# Altium project PCB_Project1.PrjPCB
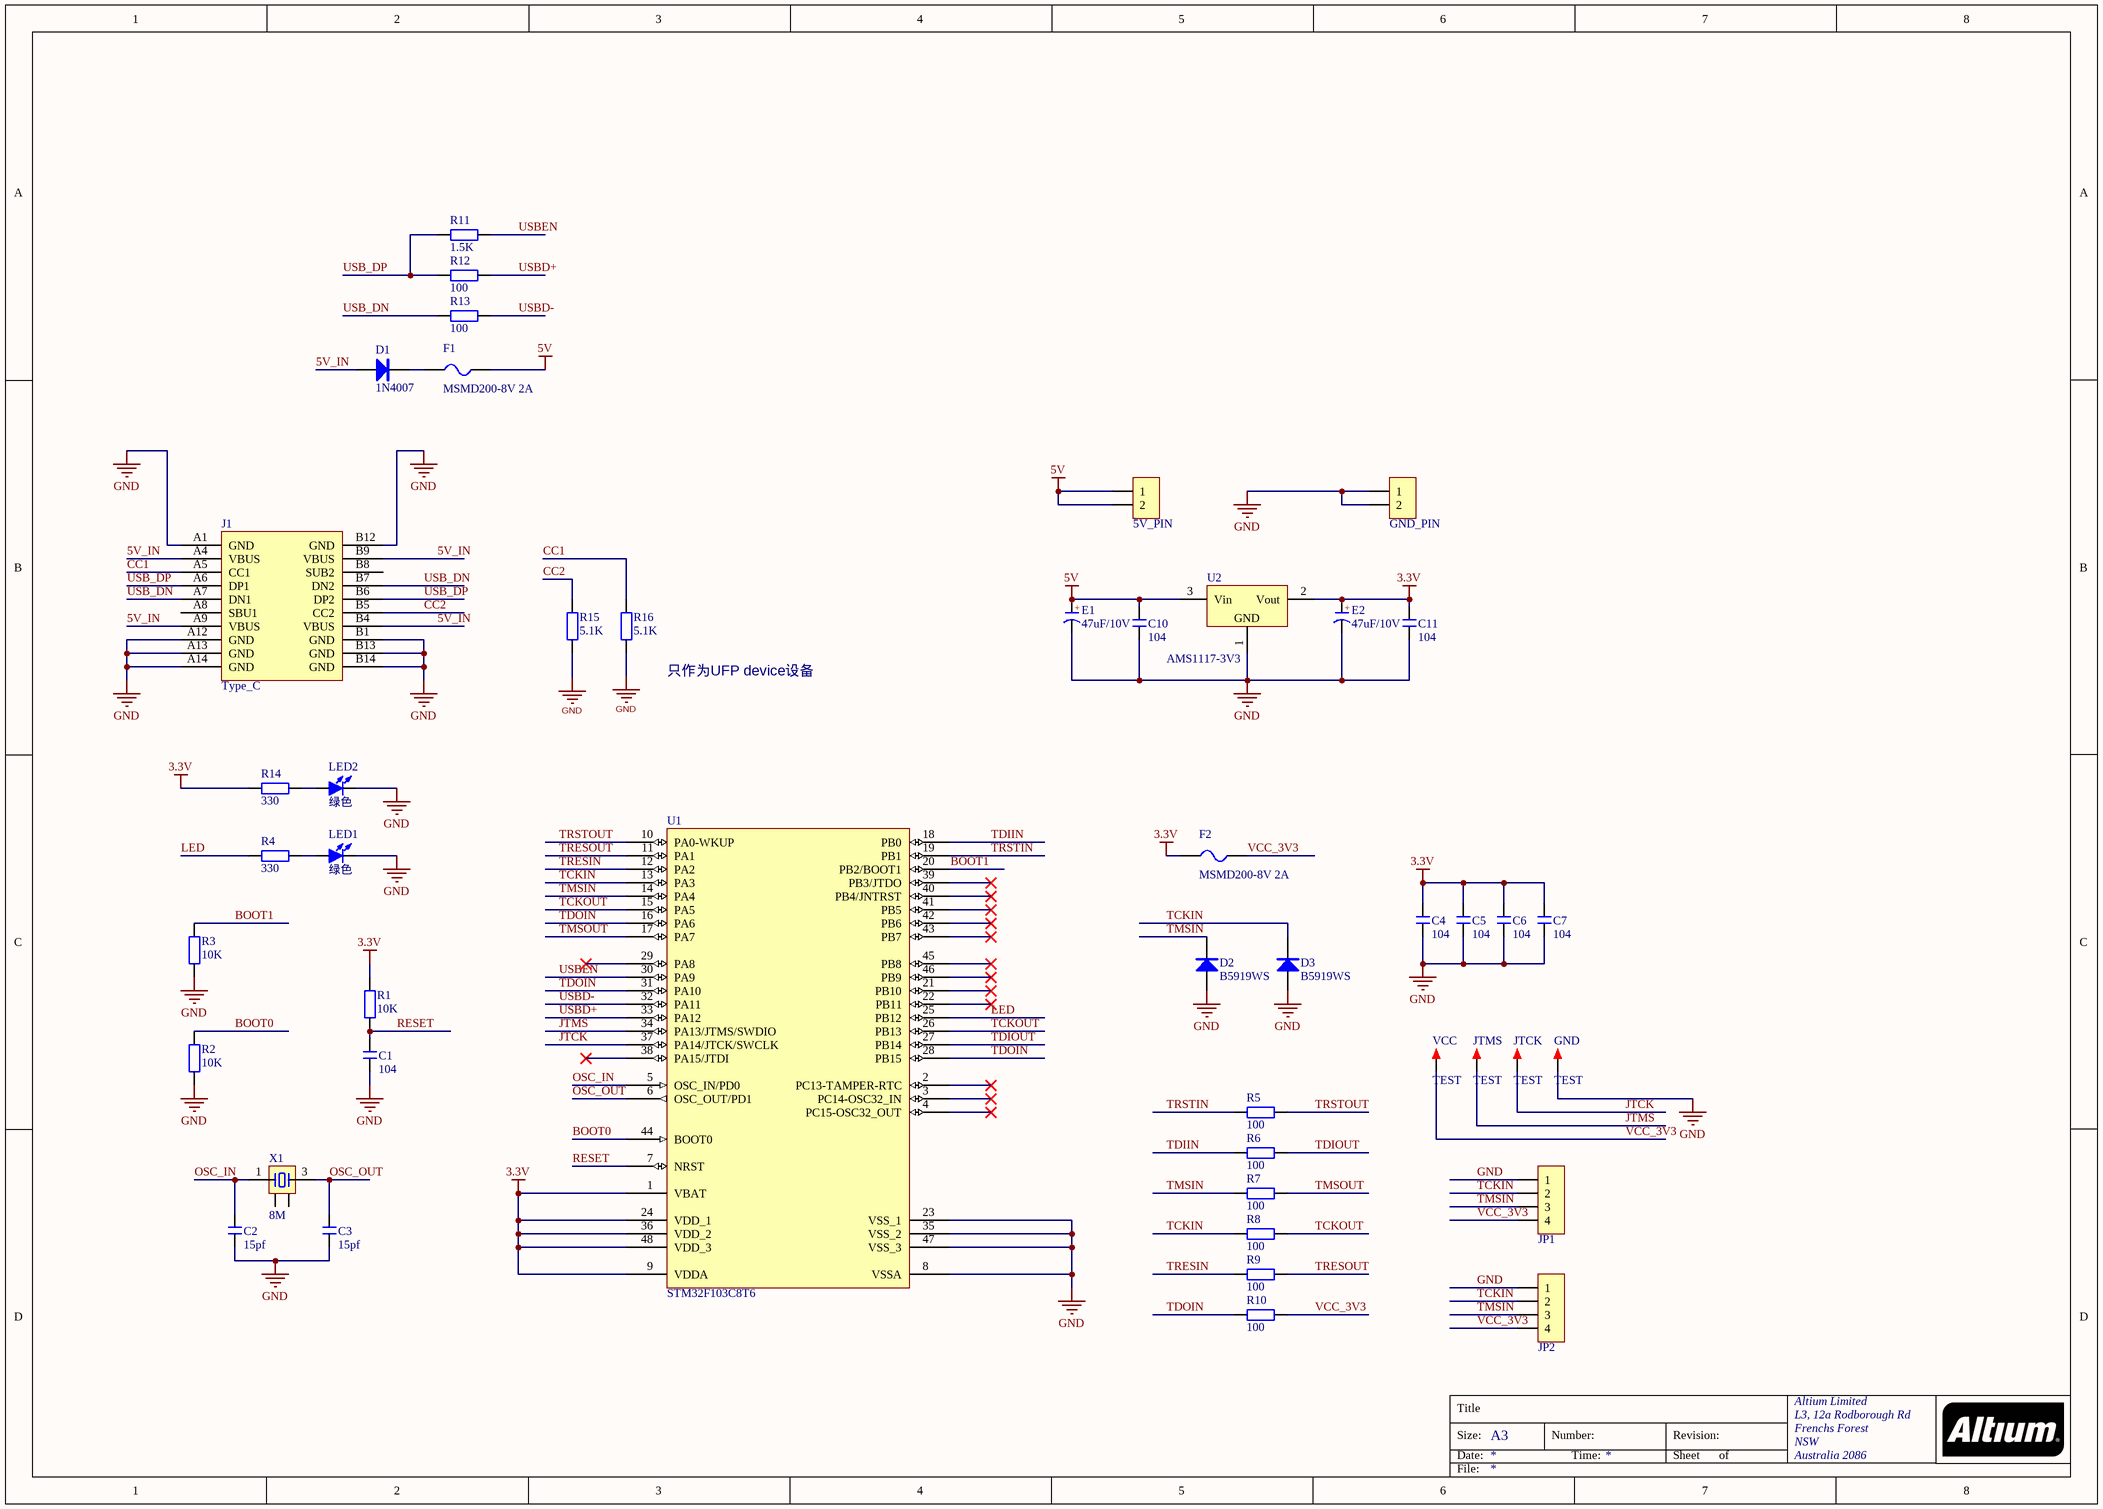
[diagram p0: Sheet1.SchDoc]
1 sheet, 46 parts. Net scope: global (net labels, ports and power ports of the same name join across sheets).
Board file: PCB1.PcbDoc

## Sheet Sheet1.SchDoc
size A3; Organization: Altium Limited; Address1: L3, 12a Rodborough Rd; Address2: Frenchs Forest; Address3: NSW; Address4: Australia 2086

### Parts
5V_PIN  HDR-1X2  [HDR2.54-LI-2P]  (value not drawn)
C1  104  [C 0603_L]
C2  15pf  [C 0603_L]
C3  15pf  [C 0603_L]
C4  104  [C 0603_L]
C5  104  [C 0603_L]
C6  104  [C 0603_L]
C7  104  [C 0603_L]
C10  104  [C 0603_L]
C11  104  [C 0603_L]
D1  1N4007  [SOD-123]
D2  B5919WS  [SOD-323]
D3  B5919WS  [SOD-323]
E1  47uF/10V  [CD B(3528)]
E2  47uF/10V  [CD B(3528)]
F1  MSMD200-8V 2A  [FU 0805]
F2  MSMD200-8V 2A  [FU 0805]
GND  TEST  [TEST 1.4]
GND_PIN  HDR-1X2  [HDR2.54-LI-2P]  (value not drawn)
J1  Type_C  [TYPE-C-16P]
JP1  HDR-1X4  [MX 1.25-WI-4P]  (value not drawn)
JP2  HDR-1X4  [XH2.54-WI-4P]  (value not drawn)
JTCK  TEST  [TEST 1.4]
JTMS  TEST  [TEST 1.4]
LED1  绿色  [LED 0805G]
LED2  绿色  [LED 0805G]
R1  10K  [R 0603_L]
R2  10K  [R 0603_L]
R3  10K  [R 0603_L]
R4  330  [R 0603_L]
R5  100  [R 0603_L]
R6  100  [R 0603_L]
R7  100  [R 0603_L]
R8  100  [R 0603_L]
R9  100  [R 0603_L]
R10  100  [R 0603_L]
R11  1.5K  [R 0603_L]
R12  100  [R 0603_L]
R13  100  [R 0603_L]
R14  330  [R 0603_L]
R15  5.1K  [R 0603_L]
R16  5.1K  [R 0603_L]
U1  STM32F103C8T6  [LQFP48_N]
U2  AMS1117-3V3  [SOT223_L]
VCC  TEST  [TEST 1.4]
X1  8M  [OSC 5032-4P]

### Nets
3.3V: C4.2 C5.2 C6.2 C7.2 C11.2 E2.1(A) F2.1 R1.2 R14.2 U1.1(VBAT) U1.9(VDDA) U1.24(VDD_1) U1.36(VDD_2) U1.48(VDD_3) U2.2(Vout)
5V: 5V_PIN.1 5V_PIN.2 C10.2 E1.1(A) F1.2 U2.3(Vin)
GND: C1.1 C2.1 C3.1 C4.1 C5.1 C6.1 C7.1 C10.1 C11.1 D2.1(A) D3.1(A) E1.2(K) E2.2(K) GND.1 GND_PIN.1 GND_PIN.2 J1.A1(GND) J1.A12(GND) J1.A13(GND) J1.A14(GND) J1.B1(GND) J1.B12(GND) J1.B13(GND) J1.B14(GND) JP1.1 JP2.1 LED1.2(K) LED2.2(K) R2.2 R3.2 R15.2 R16.2 U1.8(VSSA) U1.23(VSS_1) U1.35(VSS_2) U1.47(VSS_3) U2.1(GND)
5V_IN: D1.1(A) J1.A4(VBUS) J1.A9(VBUS) J1.B4(VBUS) J1.B9(VBUS)
BOOT0: R2.1 U1.44(BOOT0)
BOOT1: R3.1 U1.20(PB2/BOOT1)
CC1: J1.A5(CC1) R16.1
CC2: J1.B5(CC2) R15.1
JTCK: JTCK.1 U1.37(PA14/JTCK/SWCLK)
JTMS: JTMS.1 U1.34(PA13/JTMS/SWDIO)
LED: R4.2 U1.25(PB12)
OSC_IN: C2.2 U1.5(OSC_IN/PD0) X1.1
OSC_OUT: C3.2 U1.6(OSC_OUT/PD1) X1.3
RESET: C1.2 R1.1 U1.7(NRST)
TCKIN: D3.2(K) JP1.2 JP2.2 R8.2 U1.13(PA3)
TCKOUT: R8.1 U1.15(PA5) U1.26(PB13)
TDIIN: R6.2 U1.18(PB0)
TDIOUT: R6.1 U1.27(PB14)
TDOIN: R10.2 U1.16(PA6) U1.28(PB15) U1.31(PA10)
TMSIN: D2.2(K) JP1.3 JP2.3 R7.2 U1.14(PA4)
TMSOUT: R7.1 U1.17(PA7)
TRESIN: R9.2 U1.12(PA2)
TRESOUT: R9.1 U1.11(PA1)
TRSTIN: R5.2 U1.19(PB1)
TRSTOUT: R5.1 U1.10(PA0-WKUP)
USB_DN: J1.A7(DN1) J1.B7(DN2) R13.2
USB_DP: J1.A6(DP1) J1.B6(DP2) R11.2 R12.2
USBD+: R12.1 U1.33(PA12)
USBD-: R13.1 U1.32(PA11)
USBEN: R11.1 U1.30(PA9)
VCC_3V3: F2.2 JP1.4 JP2.4 R10.1 VCC.1
NetD1_2: D1.2(K) F1.1
NetLED1_1: LED1.1(A) R4.1
NetLED2_1: LED2.1(A) R14.1

Not connected (* = marked no-connect by the designer): J1 A8(SBU1) B8(SUB2); U1 2(PC13-TAMPER-RTC)* 3(PC14-OSC32_IN)* 4(PC15-OSC32_OUT)* 21(PB10)* 22(PB11)* 29(PA8)* 38(PA15/JTDI)* 39(PB3/JTDO)* 40(PB4/JNTRST)* 41(PB5)* 42(PB6)* 43(PB7)* 45(PB8)* 46(PB9)*; X1 2 4

### Notes on the sheet
- (near R16) 只作为UFP device设备
- Title
- Size:
- Date:
- A3
- Number:
- Time:
- Revision:
- Sheet
- of
- File:
- (in symbol C-CD) +

### Library data of the parts
5V_PIN GND_PIN = Header 2: 2P接插件; 版权归属: 源创客; BOM名称: 2P接插件; 学习资源: www.ooocke.com
C1-C7 C10 C11 = C: 无极性贴片电容; 版权归属: 源创客; BOM名称: 无极性贴片电容; 学习资源: www.ooocke.com
D1 = 1N4007: 整流二极管; 版权归属: 源创客; BOM名称: 整流二极管; 学习资源: www.ooocke.com
D2 D3 = 1N5819: 肖特基二极管; 版权归属: 源创客; 属性: 40V/2A; BOM名称: 肖特基二极管; 学习资源: www.ooocke.com
E1 E2 = C-CD: 贴片钽电容; 版权归属: 源创客; BOM名称: 贴片钽电容; 学习资源: www.ooocke.com
F1 F2 = FU: 贴片保险丝; 版权归属: 源创客; BOM名称: 贴片保险丝; 学习资源: www.ooocke.com
GND JTCK JTMS VCC = TEST: 测试点; 版权归属: 源创客; BOM名称: 测试点; 学习资源: www.ooocke.com
J1 = Type_C: 厂家：乐沪，型号：USB TYPE C 16PF
JP1 JP2 = Header 4: 4P接插件; 版权归属: 源创客; BOM名称: 4P接插件; 学习资源: www.ooocke.com
LED1 LED2 = LED-SMD: 贴片LED; 版权归属: 源创客; BOM名称: 贴片LED; 学习资源: www.ooocke.com
R1-R16 = R: 贴片电阻; 版权归属: 源创客; BOM名称: 贴片电阻; 学习资源: www.ooocke.com
U1 = STM32F103C8T6: STM32 ARM-based 32-bit MCU with 64 Kbytes Flash, 48-pin LQFP, Industrial Temperature; Published: 30-May-2008; DatasheetVersion: rev6, Mar-2008; PackageVersion: Mar-2008; PackageReference: LQFP48; Publisher: Altium Limited; PackageDescription: 48-Pin Low-Profile Quad Flat Pack, 7 x 7 mm Body, 0.5 mm Pitch (LQFP48); ComponentLink1Description: Manufacturer Link; ComponentLink1URL: www.st.com/stm32; ComponentLink2Description: Datasheet; ComponentLink2URL: http://www.st.com/stonline/products/literature/ds/13587.pdf
U2 = AMS1117: 三端稳压芯片; BOM名称: 稳压芯片; 版权归属: 源创客; 学习资源: www.ooocke.com
X1 = XTAL-4P: 4脚无源晶振; 版权归属: 源创客; BOM名称: 4脚无源晶振; 学习资源: www.ooocke.com